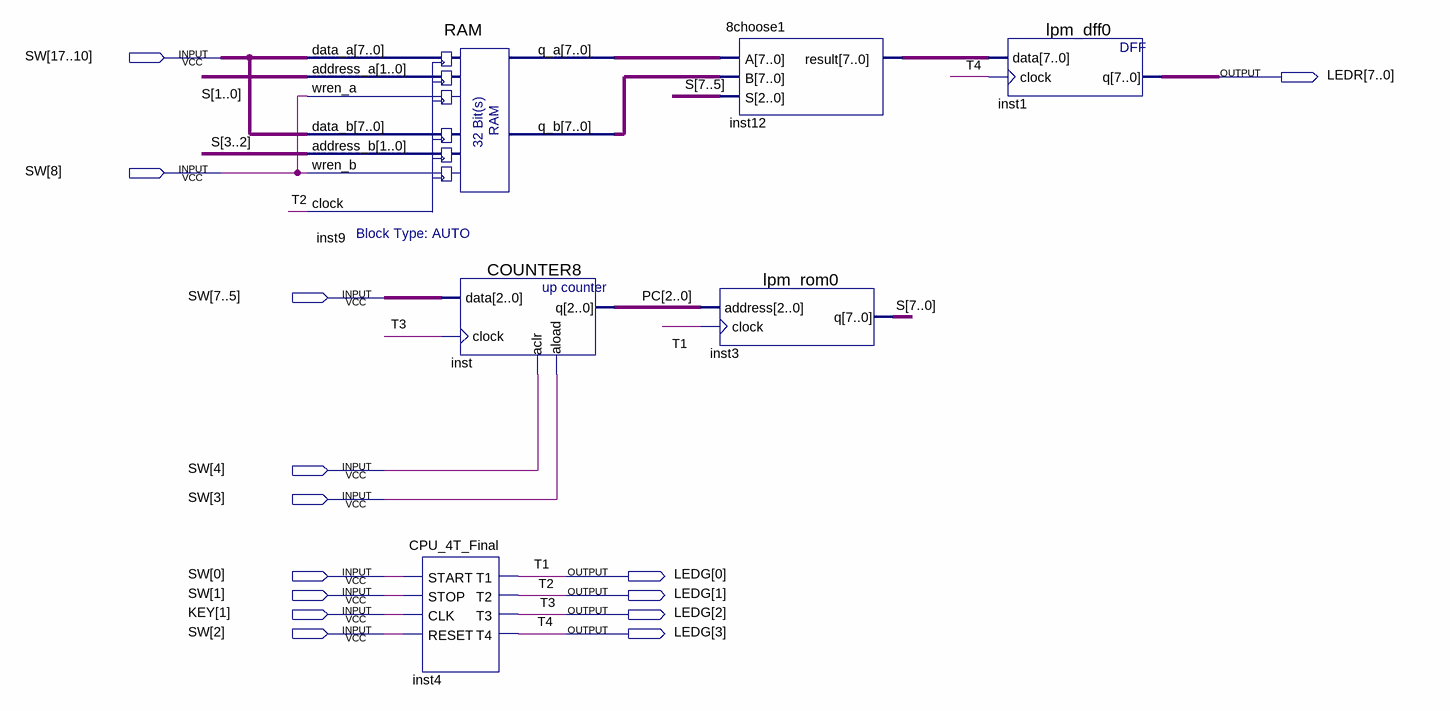
[diagram p0: schematic sheet]
// Quartus schematic CPU3.0.bdf as structural Verilog: 6 symbols, 14 pins
module \CPU3.0  (
  input  [17:0] SW,
  input  [1:1] KEY,
  output [7:0] LEDR,
  output [3:0] LEDG
);

  wire [2:0] PC;
  wire [7:0] inst9_q_a, inst9_q_b, inst12_result, S;

  RAM inst9 (
    .data_a(SW[17:10]), .address_a(S[1:0]), .wren_a(SW[8]), .data_b(SW[17:10]), .address_b(S[3:2]),
    .wren_b(SW[8]), .clock(LEDG[1]), .q_a(inst9_q_a), .q_b(inst9_q_b));
  CPU_4T_Final inst4 (
    .START(SW[0]), .STOP(SW[1]), .CLK(KEY[1]), .RESET(SW[2]), .T1(LEDG[0]), .T2(LEDG[1]), .T3(LEDG[2]),
    .T4(LEDG[3]));
  COUNTER8 inst (.data(SW[7:5]), .clock(LEDG[2]), .aclr(SW[4]), .aload(SW[3]), .q(PC));
  lpm_rom0 inst3 (.address(PC), .clock(LEDG[0]), .q(S));
  \8choose1  inst12 (.A(inst9_q_a), .B(inst9_q_b), .S(S[7:5]), .result(inst12_result));
  lpm_dff0 inst1 (.data(inst12_result), .clock(LEDG[3]), .q(LEDR));

  // Other names for the same wires on the sheet: T1 = LEDG[0]; T2 = LEDG[1]; T3 = LEDG[2]; T4 = LEDG[3]
endmodule
